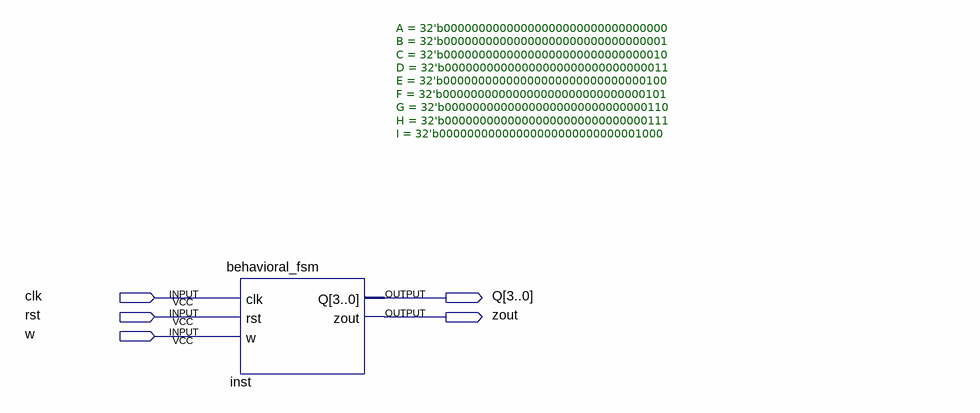
[diagram p0: schematic sheet]
// Quartus schematic Lab7Part2.bdf as structural Verilog: 1 symbols, 5 pins
module Lab7Part2 (
  input  clk,
  input  rst,
  input  w,
  output [3:0] Q,
  output zout
);

  behavioral_fsm #(.A(32'b00000000000000000000000000000000), .B(32'b00000000000000000000000000000001), .C(32'b00000000000000000000000000000010), .D(32'b00000000000000000000000000000011), .E(32'b00000000000000000000000000000100), .F(32'b00000000000000000000000000000101), .G(32'b00000000000000000000000000000110), .H(32'b00000000000000000000000000000111), .I(32'b00000000000000000000000000001000)) inst (
    .clk(clk), .rst(rst), .w(w), .Q(Q), .zout(zout));
endmodule
